# Altium schematic sheet Power_Diagram.SchDoc
size A; SheetNumber: 2; SheetTotal: 8
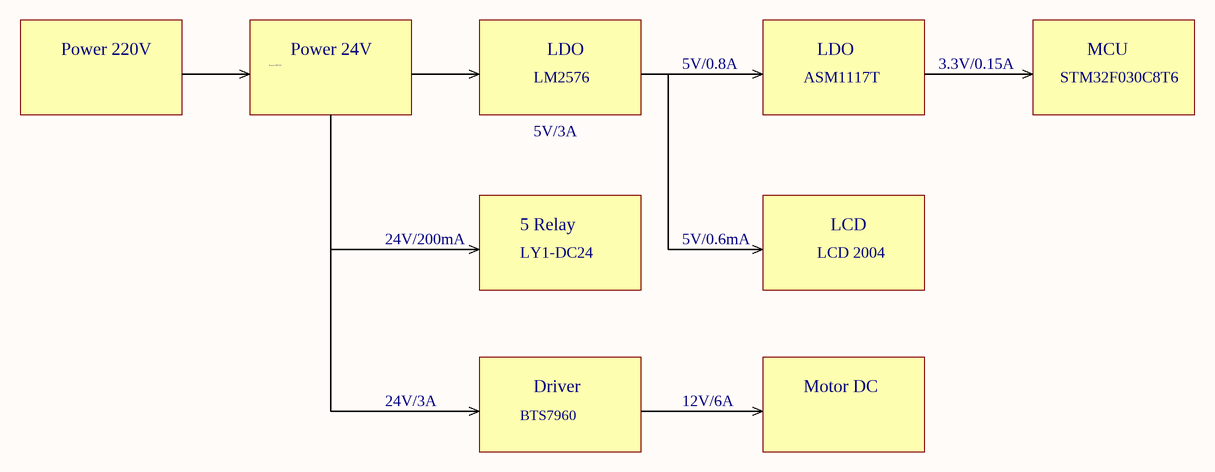
[diagram p0: Power_Diagram.SchDoc]

## Notes on the sheet
- Power 220V
- Power 220VAC
- Power 24V
- LM2576
- LDO
- 5V/0.8A
- ASM1117T
- 3.3V/0.15A
- STM32F030C8T6
- MCU
- 5V/3A
- 24V/200mA
- 5 Relay
- 5V/0.6mA
- LCD
- LY1-DC24
- LCD 2004
- 24V/3A
- BTS7960
- Driver
- 12V/6A
- Motor DC